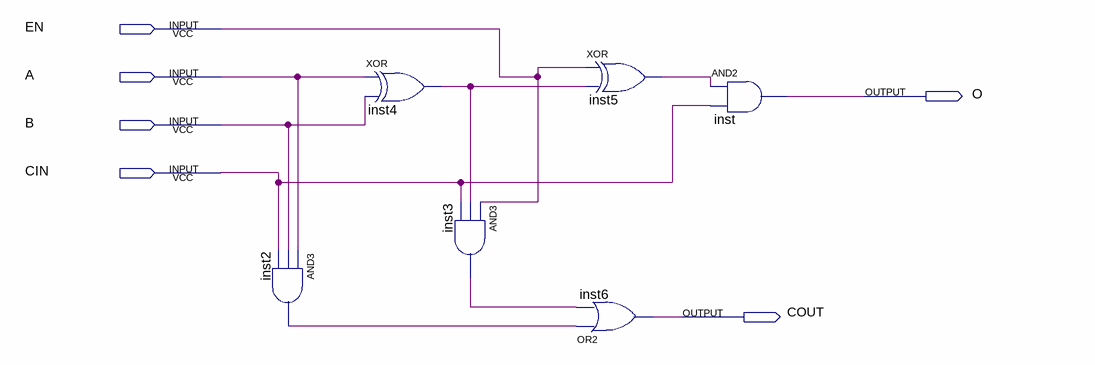
[diagram p0: schematic sheet]
// Quartus schematic FULL_ADDER1bit.bdf as structural Verilog: 6 symbols, 6 pins
module FULL_ADDER1bit (
  input  EN,
  input  A,
  input  B,
  input  CIN,
  output O,
  output COUT
);

  wire inst2_out, inst3_out, inst4_out, inst5_out;

  and inst2 (inst2_out, A, B, CIN);
  xor inst4 (inst4_out, A, B);
  and inst3 (inst3_out, EN, inst4_out, CIN);
  xor inst5 (inst5_out, EN, inst4_out);
  or inst6 (COUT, inst2_out, inst3_out);
  and inst (O, inst5_out, CIN);
endmodule
